# Altium project TARP Motor Control.PrjPcb
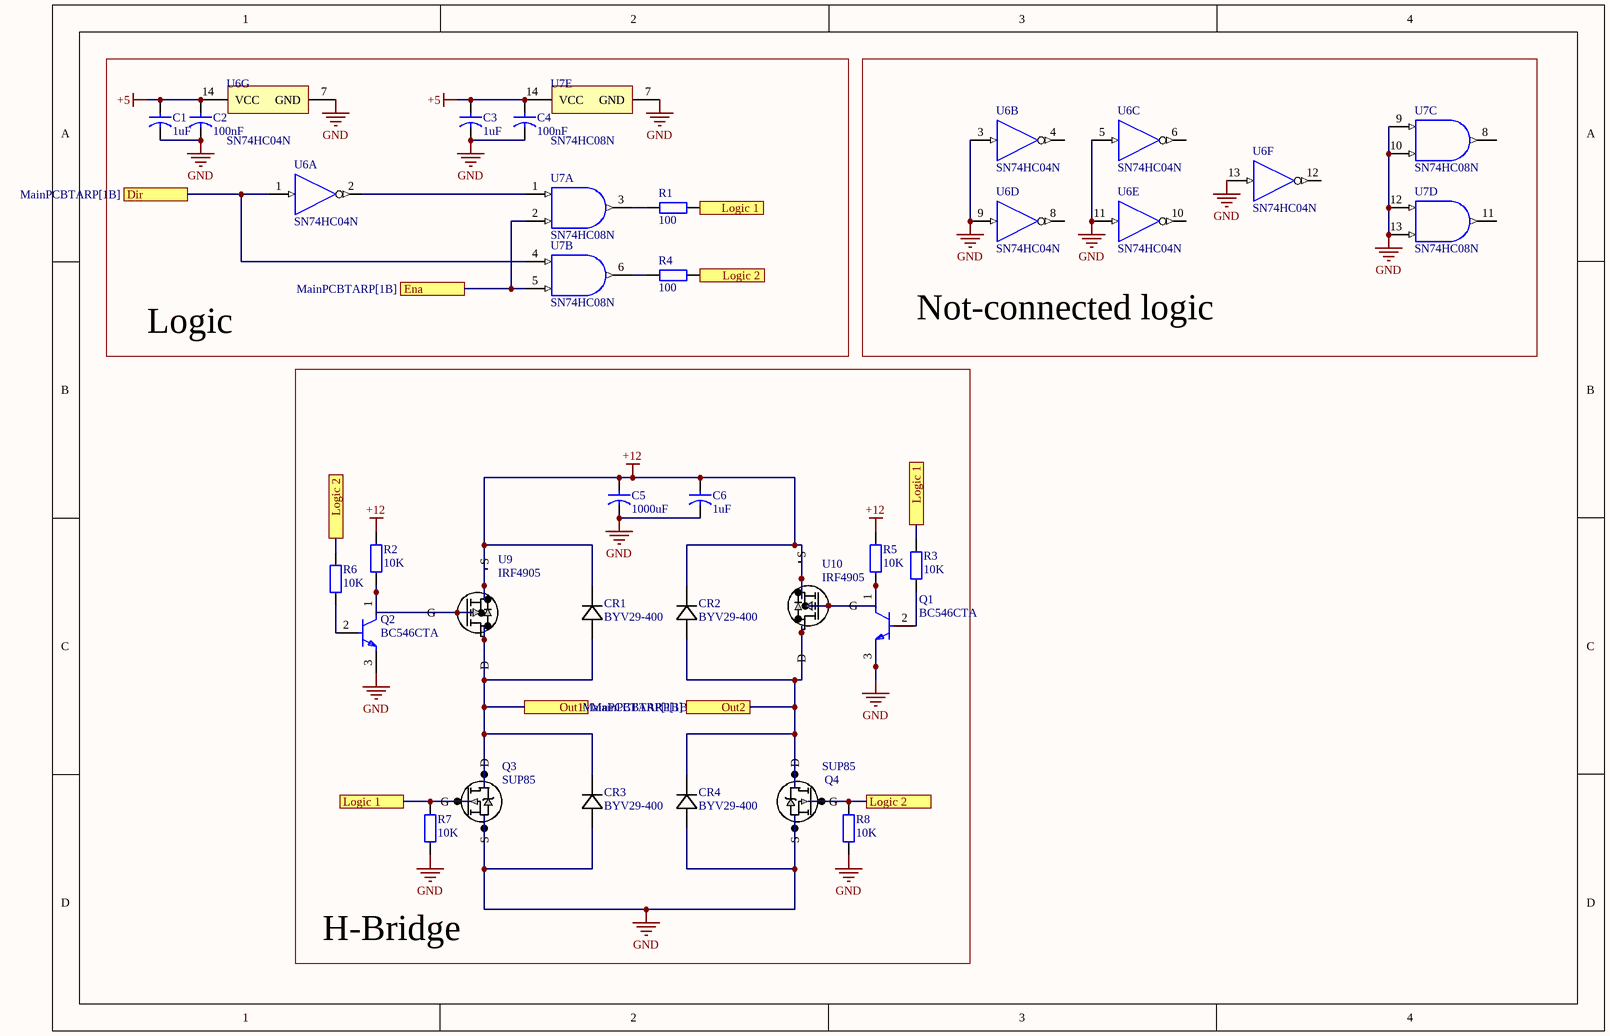
[diagram p0: H-bridge.SchDoc]
2 sheets, 58 parts. Net scope: flat (ports and power ports of the same name join across sheets).
Board files: H-bridge 2.0.PcbDoc, MainPCB.PcbDoc
Sheets:
  H-bridge.SchDoc
  MainPCBTARP.SchDoc

## Sheet H-bridge.SchDoc
size A4; SheetNumber: 1; SheetTotal: 2

### Parts
C1  value 1uF  [Cap Lyt Ø8]  (hidden comment: Cap)
C2  value 100nF  [Cap Lyt Ø8]  (hidden comment: Cap)
C3  value 1uF  [Cap Lyt Ø8]  (hidden comment: Cap)
C4  value 100nF  [Cap Lyt Ø8]  (hidden comment: Cap)
C5  value 1000uF  [Cap Lyt Ø18]  (hidden comment: Cap)
C6  value 1uF  [Cap Lyt Ø8]  (hidden comment: Cap)
CR1  BYV29-400  [SOD59_WEN]
CR2  BYV29-400  [SOD59_WEN]
CR3  BYV29-400  [SOD59_WEN]
CR4  BYV29-400  [SOD59_WEN]
Q1  BC546CTA  [FP-135AR-MFG]
Q2  BC546CTA  [FP-135AR-MFG]
Q3  SUP85  [PG-TO251-3-901_INF]
Q4  SUP85  [PG-TO251-3-901_INF]
R1  value 100  [RES THT 9mm]  (hidden comment: Resistor)
R2  value 10K  [RES THT 9mm]  (hidden comment: Resistor)
R3  value 10K  [RES THT 9mm]  (hidden comment: Resistor)
R4  value 100  [RES THT 9mm]  (hidden comment: Resistor)
R5  value 10K  [RES THT 9mm]  (hidden comment: Resistor)
R6  value 10K  [RES THT 9mm]  (hidden comment: Resistor)
R7  value 10K  [RES THT 9mm]  (hidden comment: Resistor)
R8  value 10K  [RES THT 9mm]  (hidden comment: Resistor)
U6  SN74HC04N  [N0014A]  (parts A,B,C,D,E,F,G of 7)
U7  SN74HC08N  [N0014A]  (parts A,B,C,D,E of 5)
U9  IRF4905  [TO220AB_VIS]
U10  IRF4905  [TO220AB_VIS]

### Blocks framed on the sheet
Logic: C1-C4 R1 R4 U6 U7
Not-connected logic: U6 U7
H-Bridge: C5 C6 CR1-CR4 Q1-Q4 R2 R3 R5-R8 U9 U10

### Ports
Dir (see MainPCBTARP[1B]), Ena (see MainPCBTARP[1B]), Logic 1 (see H-bridge[1D], H-bridge[2A]), Logic 1 (see H-bridge[1D], H-bridge[3C]), Logic 1 (see H-bridge[2A], H-bridge[3C]), Logic 2 (see H-bridge[1C], H-bridge[2B]), Logic 2 (see H-bridge[1C], H-bridge[3D]), Logic 2 (see H-bridge[2B], H-bridge[3D]), Out1 (see MainPCBTARP[1B]), Out2 (see MainPCBTARP[1B])

### Nets
+5: C1.1 C2.1 C3.1 C4.1 U6.14(VCC) U7.14(VCC)
+12: C5.1 C6.1 CR1.1 CR2.1 R2.2 R5.2 U9.3(S) U10.3(S)
GND: C1.2(g) C2.2(g) C3.2(g) C4.2(g) C5.2(g) C6.2(g) CR3.2 CR4.2 Q1.3(E) Q2.3(E) Q3.3(S) Q4.3(S) R7.1 R8.1 U6.3(2A) U6.5(3A) U6.7(GND) U6.9(4A) U6.11(5A) U6.13(6A) U7.7(GND) U7.9(3A) U7.10(3B) U7.12(4A) U7.13(4B)
NetCR1_2: CR1.2 CR3.1 Q3.2(D) U9.2(D) ; port Out1
NetCR2_2: CR2.2 CR4.1 Q4.2(D) U10.2(D) ; port Out2
NetJ10_6: U7.2(1B) U7.5(2B) ; port Ena
NetJ10_7: U6.1(1A) U7.4(2A) ; port Dir
NetQ1_1: Q1.1(C) R5.1 U10.1(G)
NetQ1_2: Q1.2(B) R3.1
NetQ2_1: Q2.1(C) R2.1 U9.1(G)
NetQ2_2: Q2.2(B) R6.1
NetQ3_1: Q3.1(G) R1.1 R3.2 R7.2 ; port Logic 1
NetQ4_1: Q4.1(G) R4.2 R6.2 R8.2 ; port Logic 2
NetR1_2: R1.2 U7.3(1Y)
NetR4_1: R4.1 U7.6(2Y)
NetU6_2: U6.2(~{1Y}) U7.1(1A)

Not connected (* = marked no-connect by the designer): U6 4(~{2Y}) 6(~{3Y}) 8(~{4Y}) 10(~{5Y}) 12(~{6Y}); U7 8(3Y) 11(4Y)

### Library data of the parts
C1-C6 = Capacitor electrolytic
CR1-CR4 = BYV29-500: No Description Available; Manufacturer_Name: WeEN Semiconductors; Copyright: Copyright (C) 2025 Ultra Librarian. All rights reserved.; Manufacturer_Part_Number: BYV29-500
Q1 Q2 = CMP-00278-84408942-1: BC546CTA Small Signal Bipolar Transistor, 0.1A I(C), 65V V(BR)CEO, 1-Element, NPN, Silicon, TO-92; Manufacturer Lifecycle Status: ACTIVE; Gain Bandwidth Product: 300MHz; Emitter Base Voltage (VEBO): 6V; Element Configuration: Single; Max Power Dissipation: 500mW; Max Collector Current: 100mA; Number of Elements: 1; Collector Base Voltage (VCBO): 80V; Max Junction Temperature (Tj): 150°C; hFE Min: 110; Collector Emitter Saturation Voltage: 250mV; Lead Free: Lead Free; Max Breakdown Voltage: 65V; Collector Emitter Breakdown Voltage: 65V; Collector Emitter Voltage (VCEO): 65V; Voltage Rating (DC): 65V; Weight: 240mg; Polarity: NPN; Schedule B: 8541210080, 8541210080; Contact Plating: Tin; Lifecycle Status: Production; Mount: Through Hole; Length: 4.58mm; Number of Pins: 3; Current Rating: 100mA; Width: 3.86mm; Transition Frequency: 300MHz; Case/Package: TO-92-3; Frequency: 300MHz; Power Dissipation: 500mW; Max Operating Temperature: 150°C; Min Operating Temperature: -65°C; Max Frequency: 300MHz; Height: 4.58mm; Radiation Hardening: No; NexarPartId: 84408942; RoHS: Compliant
Q3 Q4 = IRLU024NPBF: The IR MOSFET family of power MOSFETs utilizes proven silicon processes offering designers a wide portfolio of devices to support various applications such as DC motors, inverters, SMPS, lighting, load switches as well as battery powered applications.The devices are available in a variety of surface mount and through-hole packages with industry standard footprints for ease of design.; Manufacturer_Name: Infineon; Copyright: Copyright (C) 2025 Ultra Librarian. All rights reserved.; Manufacturer_Part_Number: IRLU024NPBF; Datasheet: https://www.infineon.com/dgdl/irlr024npbf.pdf?fileId=5546d462533600a4015356694f7f265d
U6 = CMP-1615-00892-2: Hex Inverters, N0014A, TUBE; Manufacturer: Texas Instruments; VCC(Min)(V): 2; Bits(#): 6; Technology Family: HC; tpd @ Nom Voltage(Max)(ns): 20; Output Drive (IOL/IOH)(Max)(mA): -4/4; Rating: Catalog; Voltage(Nom)(V): 5; Schmitt Trigger: No; ICC @ Nom Voltage(Max)(mA): 0.02; Input Type: CMOS; Code_JEDEC: MS-001; PackageReference: N0014A; DatasheetVersion: SCLS078F; Output Type: CMOS; VCC(Max)(V): 6; Operating Temperature Range(C): -40 to 85; Generic Part Number: SN74HC04; F @ Nom Voltage(Max)(Mhz): 20
U7 = CMP-0777-00250-3: Quadruple 2-Input Positive-AND Gates, N0014A, TUBE; Manufacturer: Texas Instruments; Output Type: CMOS; ICC @ Nom Voltage(Max)(mA): 0.02; tpd @ Nom Voltage(Max)(ns): 28; Voltage(Nom)(V): 5; VCC(Min)(V): 2; Technology Family: HC; F @ Nom Voltage(Max)(Mhz): 70; Rating: Catalog; Bits(#): 4; Schmitt Trigger: No; VCC(Max)(V): 6; PackageReference: N0014A; Input Type: CMOS; Generic Part Number: SN74HC08; DatasheetVersion: SCLS081F; Operating Temperature Range(C): -40 to 85
U9 U10 = IRF9530PBF: MOSFET P-CHANNEL 100V; Manufacturer_Name: Vishay; Copyright: Copyright (C) 2025 Ultra Librarian. All rights reserved.; Manufacturer_Part_Number: IRF9530PBF

## Sheet MainPCBTARP.SchDoc
size A4; SheetNumber: 2; SheetTotal: 2
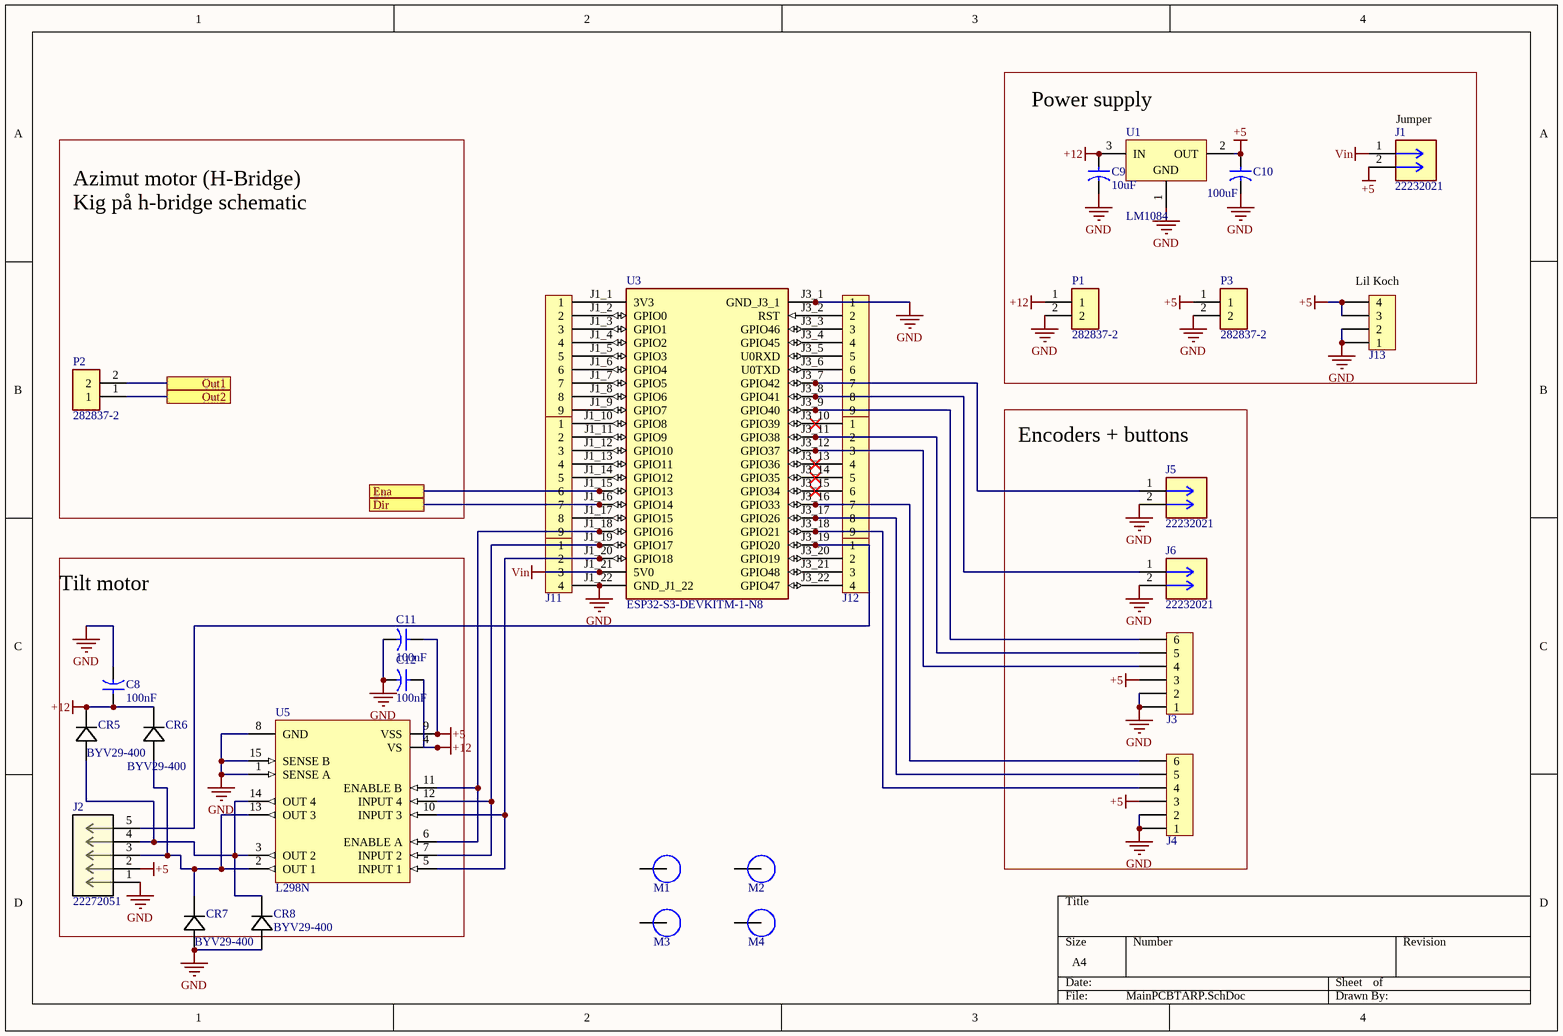
[diagram p1: MainPCBTARP.SchDoc]

### Parts
C8  value 100nF  [Cap Lyt Ø8]  (hidden comment: Cap)
C9  value 10uF  [Cap Lyt Ø8]  (hidden comment: Cap)
C10  value 100uF  [Cap Lyt Ø8]  (hidden comment: Cap)
C11  value 100nF  [Cap Lyt Ø8]  (hidden comment: Cap)
C12  value 100nF  [Cap Lyt Ø8]  (hidden comment: Cap)
CR5  BYV29-400  [SOD59_WEN]
CR6  BYV29-400  [SOD59_WEN]
CR7  BYV29-400  [SOD59_WEN]
CR8  BYV29-400  [SOD59_WEN]
J1  22232021  [CONN_A-6373-02A_MOL]
J2  22272051  [CONN_AE-6410-05A_MOL]
J3  Header 1x6  [Header 1x6]  (value not drawn)
J4  Header 1x6  [Header 1x6]  (value not drawn)
J5  22232021  [CONN_A-6373-02A_MOL]
J6  22232021  [CONN_A-6373-02A_MOL]
J7  Header 1x9  [Header 1x9]  (value not drawn)
J8  Header 1x9  [Header 1x9]  (value not drawn)
J9  Header 1x9  [Header 1x9]  (value not drawn)
J10  Header 1x9  [Header 1x9]  (value not drawn)
J11  Header 1x4  [Header 1x4]  (value not drawn)
J12  Header 1x4  [Header 1x4]  (value not drawn)
J13  Header 1x4  [Header 1x4]  (value not drawn)
M1  Screw Hole  [M3 Hole]  (value not drawn)  (no BOM)
M2  Screw Hole  [M3 Hole]  (value not drawn)  (no BOM)
M3  Screw Hole  [M3 Hole]  (value not drawn)  (no BOM)
M4  Screw Hole  [M3 Hole]  (value not drawn)  (no BOM)
P1  282837-2  [TE_282837-2]
P2  282837-2  [TE_282837-2]
P3  282837-2  [TE_282837-2]
U1  LM1084  [T03B]
U3  ESP32-S3-DEVKITM-1-N8  [MODULE_ESP32-S3-DEVKITM-1-N8]
U5  L298N  [STM-FM-15]

### Blocks framed on the sheet
Power supply: C9 C10 J1 J13 P1 P3 U1

### Ports
Dir (see H-bridge[1A]), Ena (see H-bridge[1B]), Out1 (see H-bridge[2C]), Out2 (see H-bridge[2C])

### Nets
+5: C10.1 C11.1 J1.2 J2.2 J3.3 J4.3 J13.3 J13.4 P3.1 U1.2(OUT) U5.9(VSS)
+12: C8.1 C9.1 C12.1 CR5.1 CR6.1 P1.1 U1.3(IN) U5.4(VS)
GND: C8.2(g) C9.2(g) C10.2(g) C11.2(g) C12.2(g) CR7.2 CR8.2 J2.1 J3.1 J3.2 J4.1 J4.2 J5.2 J6.2 J7.1 J11.4 J13.1 J13.2 P1.2 P3.2 U1.1(GND) U3.J1_22(GND_J1_22) U3.J3_1(GND_J3_1) U5.1(SENSE_A) U5.8(GND) U5.15(SENSE_B)
Vin: J1.1 J11.3 U3.J1_21(5V0)
NetCR1_2: P2.2 ; port Out1
NetCR2_2: P2.1 ; port Out2
NetCR5_2: CR5.2 CR8.1 J2.4 U5.3(OUT_2) U5.14(OUT_4)
NetCR6_2: CR6.2 CR7.1 J2.3 U5.2(OUT_1) U5.13(OUT_3)
NetJ2_5: J2.5 J12.1 U3.J3_19(GPIO20)
NetJ3_4: J3.4 J9.3 U3.J3_12(GPIO37)
NetJ3_5: J3.5 J9.2 U3.J3_11(GPIO38)
NetJ3_6: J3.6 J7.9 U3.J3_9(GPIO40)
NetJ4_4: J4.4 J9.9 U3.J3_18(GPIO21)
NetJ4_5: J4.5 J9.8 U3.J3_17(GPIO26)
NetJ4_6: J4.6 J9.7 U3.J3_16(GPIO33)
NetJ5_1: J5.1 J7.7 U3.J3_7(GPIO42)
NetJ6_1: J6.1 J7.8 U3.J3_8(GPIO41)
NetJ7_2: J7.2 U3.J3_2(RST)
NetJ7_3: J7.3 U3.J3_3(GPIO46)
NetJ7_4: J7.4 U3.J3_4(GPIO45)
NetJ7_5: J7.5 U3.J3_5(U0RXD)
NetJ7_6: J7.6 U3.J3_6(U0TXD)
NetJ8_1: J8.1 U3.J1_1(3V3)
NetJ8_2: J8.2 U3.J1_2(GPIO0)
NetJ8_3: J8.3 U3.J1_3(GPIO1)
NetJ8_4: J8.4 U3.J1_4(GPIO2)
NetJ8_5: J8.5 U3.J1_5(GPIO3)
NetJ8_6: J8.6 U3.J1_6(GPIO4)
NetJ8_7: J8.7 U3.J1_7(GPIO5)
NetJ8_8: J8.8 U3.J1_8(GPIO6)
NetJ8_9: J8.9 U3.J1_9(GPIO7)
NetJ9_1: J9.1 U3.J3_10(GPIO39)
NetJ9_4: J9.4 U3.J3_13(GPIO36)
NetJ9_5: J9.5 U3.J3_14(GPIO35)
NetJ9_6: J9.6 U3.J3_15(GPIO34)
NetJ10_1: J10.1 U3.J1_10(GPIO8)
NetJ10_2: J10.2 U3.J1_11(GPIO9)
NetJ10_3: J10.3 U3.J1_12(GPIO10)
NetJ10_4: J10.4 U3.J1_13(GPIO11)
NetJ10_5: J10.5 U3.J1_14(GPIO12)
NetJ10_6: J10.6 U3.J1_15(GPIO13) ; port Ena
NetJ10_7: J10.7 U3.J1_16(GPIO14) ; port Dir
NetJ10_8: J10.8 U3.J1_17(GPIO15)
NetJ10_9: J10.9 U3.J1_18(GPIO16) U5.6(ENABLE_A) U5.11(ENABLE_B)
NetJ11_1: J11.1 U3.J1_19(GPIO17) U5.7(INPUT_2) U5.12(INPUT_4)
NetJ11_2: J11.2 U3.J1_20(GPIO18) U5.5(INPUT_1) U5.10(INPUT_3)
NetJ12_2: J12.2 U3.J3_20(GPIO19)
NetJ12_3: J12.3 U3.J3_21(GPIO48)
NetJ12_4: J12.4 U3.J3_22(GPIO47)

Not connected (* = marked no-connect by the designer): M1 1; M2 1; M3 1; M4 1

### Notes on the sheet
- (near J1) Jumper
- Azimut motor (H-Bridge)
  Kig på h-bridge schematic
- (near J13) Lil Koch
- (near J5) Encoders + buttons
- Tilt motor

### Library data of the parts
C8-C12 = Capacitor electrolytic
CR5-CR8 = BYV29-500: as CR1 on sheet H-bridge; Copyright: Copyright (C) 2025 Ultra Librarian. All rights reserved.; Manufacturer_Part_Number: BYV29-500
J1 J5 J6 = CMP-005-000000-1: Connector Header Through Hole 2 position 0.100 (2.54mm); MF: Molex; Check_prices: https://www.snapeda.com/parts/22232021/Molex/view-part/?ref=eda; Design Item ID: 22232021; MP: 22232021; Component Type: Standard; Source: 22232021.SchLib; Value: *; Package: None; Pin Count: 2; SnapEDA_Link: https://www.snapeda.com/parts/22232021/Molex/view-part/?ref=snap
J2 = 22272051: KK 254 Wire-to-Board Header, Vertical, with Friction Lock, 5 Circuits, Tin (Sn) Plating; Manufacturer_Name: Molex Connector Corporation; Copyright: Copyright (C) 2025 Ultra Librarian. All rights reserved.; Manufacturer_Part_Number: 22272051; Datasheet: https://www.molex.com/en-us/products/part-detail-pdf/22272051?display=pdf; RefDes: RefDes; Type: Type
P1-P3 = CMP-007-000000-1: Ð Ð°Ð·ÑŠÐµÐ¼Ð½Ñ‹Ðµ ÐºÐ»ÐµÐ¼Ð¼Ð½Ñ‹Ðµ ÐºÐ¾Ð»Ð¾Ð´ÐºÐ¸ Ð Ð¾Ð·ÐµÑ‚ÐºÐ° 2 Ð¿Ð¾Ð»Ð¾Ð¶ÐµÐ½Ð¸Ñ 5,08 Ð¼Ð¼ ÐŸÑ€Ð¸Ð¿Ð¾Ð¹ Ð¿Ñ€ÑÐ¼Ð¾Ð¹ Ñ‡ÐµÑ€ÐµÐ· Ð¾Ñ‚Ð²ÐµÑ€ÑÑ‚Ð¸Ðµ 13,5 Ð / ÐºÐ¾Ð½Ñ‚Ð°ÐºÑ‚; MF: TE Connectivity; Price: None; MP: 282837-2; Check_prices: https://www.snapeda.com/parts/282837-2/TE+Connectivity+AMP+Connectors/view-part/?ref=eda; Value: *; Pin Count: 2; SnapEDA_Link: https://www.snapeda.com/parts/282837-2/TE+Connectivity+AMP+Connectors/view-part/?ref=snap; Component Type: Standard; Purchase-URL: https://pricing.snapeda.com/search/part/282837-2/?ref=eda; Availability: In Stock; Package: None; Source: 282837-2.SchLib; Design Item ID: 282837-2
U1 = CMP-0062-02512-2: 1.5A Low Dropout Positive Regulators, 3-pin TO-220; Manufacturer: National Semiconductor; PackageTopMarking: NSUZXYTTE#*LM1086*CT-3.3; CompType: LDO IC; PowerWise: N; ComponentLink1Description: LM1086 Datasheet; ComponentLink2Description: LM1086 Web Page; ComponentLink1URL: http://www.national.com/ds/LM/LM1086.pdf; PackageReference: T03B; PackageVersion: revL, Jan-1992; RoHS: N; DatasheetVersion: Jun-2005; PinCount: 3; ComponentLink2URL: http://www.national.com/pf/LM/LM1086.html; RevisionNote: Component URLs added; ComponentLink3Description: T03B Package Page; PackageDescription: TO-220, Molded, 3 Lead, Straight; ComponentLink3URL: http://www.national.com/packaging/folders/t03b.html
U3 = CMP-003-000000-1: MF: {'manufacturer': u'Espressif Systems'}; Package: None; Value: *; Source: ESP32-S3-DEVKITM-1-N8.SchLib; Design Item ID: ESP32-S3-DEVKITM-1-N8; Price: None; Component Type: Standard; Availability: Unavailable; Pin Count: 44; MP: ESP32-S3-DEVKITM-1-N8
U5 = CMP-2000-06526-1: Dual Full-Bridge Driver, 4.8 to 46 V, -40 to 150 degC, 15-Pin FM (MW 15L), RoHS, Tube; Manufacturer: STMicroelectronics; PartNumber: L298; Output Current: 2A; Supply Voltage Max: 7V; Driver Case Style: Multiwatt; Supply Voltage Min: 4.5V; No. of Pins: 15Pins; SVHC: NoSVHC(17-Dec-2015); Output Voltage: 46V; No. of Outputs: 4Outputs; Motor Type: FullBridge; MSL: -; Package Description: 15-Pin Flange Mount, Body 5 x 19.6 mm, Pitch 1.27 mm; Datasheet Version: 01/2000; Package Reference: FM-15; Mounting Technology: ThroughHole; Packaging: Each; Automotive Qualification Standard: -; Product Range: -; Datasheet URL: https://datasheet.ciiva.com/15109/getdatasheetpartid-50682-15109332.pdf; Operating Temperature Max: 130°C; Operating Temperature Min: -25°C; Manufacturer URL: http://www.st.com/

## Nets that join several sheets
+5: H-bridge (6 pins), MainPCBTARP (11 pins)
+12: H-bridge (8 pins), MainPCBTARP (8 pins)
GND: H-bridge (25 pins), MainPCBTARP (26 pins)
NetCR1_2: H-bridge (CR1.2 CR3.1 Q3.2 U9.2), MainPCBTARP (P2.2)
NetCR2_2: H-bridge (CR2.2 CR4.1 Q4.2 U10.2), MainPCBTARP (P2.1)
NetJ10_6: H-bridge (U7.2 U7.5), MainPCBTARP (J10.6 U3.J1_15)
NetJ10_7: H-bridge (U6.1 U7.4), MainPCBTARP (J10.7 U3.J1_16)